# EAGLE schematic EMG_digital_Part (EAGLE 9.3.0)
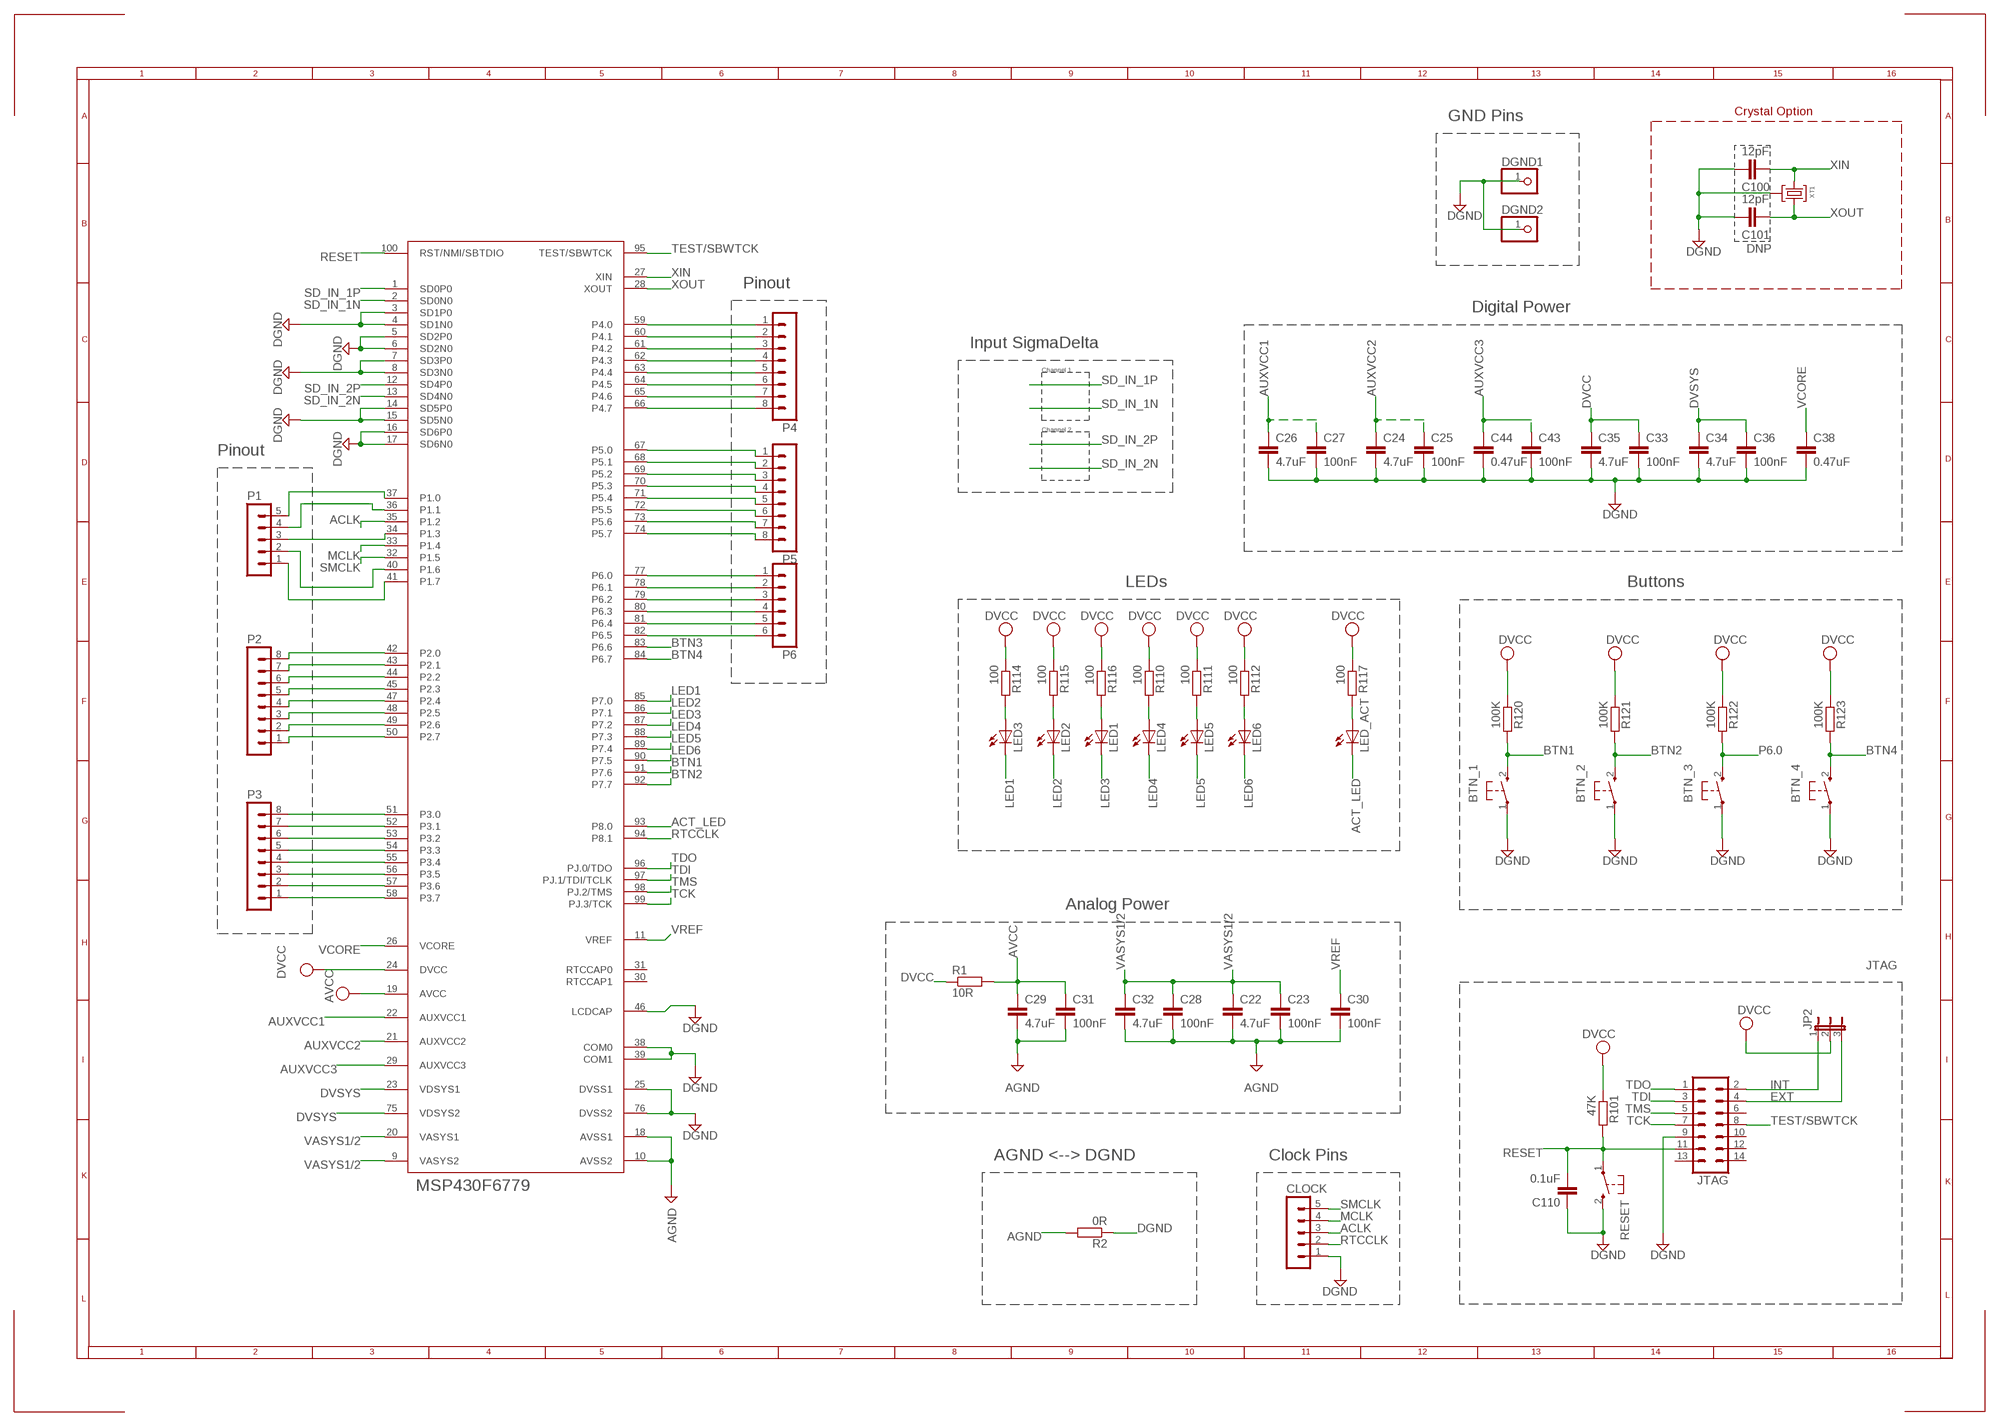
[diagram p0: schematic, sheet 1]

## Parts
BTN_1  PB  [PBTH]
BTN_2  PB  [PBTH]
BTN_3  PB  [PBTH]
BTN_4  PB  [PBTH]
C22  4.7uF  C-EUC0805  [C0805]
C23  100nF  C-EUC0805  [C0805]
C24  4.7uF  C-EUC0805  [C0805]
C25  100nF  C-EUC0805  [C0805]
C26  4.7uF  C-EUC0805  [C0805]
C27  100nF  C-EUC0805  [C0805]
C28  100nF  C-EUC0805  [C0805]
C29  4.7uF  C-EUC0805  [C0805]
C30  100nF  C-EUC0805  [C0805]
C31  100nF  C-EUC0805  [C0805]
C32  4.7uF  C-EUC0805  [C0805]
C33  100nF  C-EUC0805  [C0805]
C34  4.7uF  C-EUC0805  [C0805]
C35  4.7uF  C-EUC0805  [C0805]
C36  100nF  C-EUC0805  [C0805]
C38  0.47uF  C-EUC0805  [C0805]
C43  100nF  C-EUC0805  [C0805]
C44  0.47uF  C-EUC0805  [C0805]
C100  12pF  C-EUC0805  [C0805]
C101  12pF  C-EUC0805  [C0805]
C110  0.1uF  C-EUC0805  [C0805]
CLOCK  MA05-1  [MA05-1]
DGND1  PINHD-1X1  [1X01]
DGND2  PINHD-1X1  [1X01]
JP2  JP2E  [JP2]
JTAG  ML14  [ML14]
LED1  LED3MM  [LED3MM]
LED2  LED3MM  [LED3MM]
LED3  LED3MM  [LED3MM]
LED4  LED3MM  [LED3MM]
LED5  LED3MM  [LED3MM]
LED6  LED3MM  [LED3MM]
LED_ACT  LED3MM  [LED3MM]
P1  MA05-1  [MA05-1]
P2  MA08-1  [MA08-1]
P3  MA08-1  [MA08-1]
P4  MA08-1  [MA08-1]
P5  MA08-1  [MA08-1]
P6  MA06-1  [MA06-1]
R1  10R  R-EU_R0805  [R0805]
R2  0R  R-EU_R0805  [R0805]
R101  47K  R-EU_R0805  [R0805]
R110  100  R-EU_R0805  [R0805]
R111  100  R-EU_R0805  [R0805]
R112  100  R-EU_R0805  [R0805]
R114  100  R-EU_R0805  [R0805]
R115  100  R-EU_R0805  [R0805]
R116  100  R-EU_R0805  [R0805]
R117  100  R-EU_R0805  [R0805]
R120  100K  R-EU_R0805  [R0805]
R121  100K  R-EU_R0805  [R0805]
R122  100K  R-EU_R0805  [R0805]
R123  100K  R-EU_R0805  [R0805]
RESET  RESET  PB  [PBTH]
U$1  MSP430F6779PZ  [S-PQFP-G100(PZ)]
XT1  CM200T  [CM200T]

## Nets
ACLK: CLOCK.3 U$1.35(P1.2)
ACT_LED: LED_ACT.K(C) U$1.93(P8.0)
AGND: C22.2 C23.2 C28.2 C29.2 C30.2 C31.2 C32.2 R2.2 U$1.10(AVSS2) U$1.18(AVSS1)
AUXVCC1: C26.1 C27.1 U$1.22(AUXVCC1)
AUXVCC2: C24.1 C25.1 U$1.21(AUXVCC2)
AUXVCC3: C43.1 C44.1 U$1.29(AUXVCC3)
AVCC: C29.1 C31.1 R1.2 U$1.19(AVCC)
BTN1: BTN_1.2(S) R120.2 U$1.91(P7.6)
BTN2: BTN_2.2(S) R121.2 U$1.92(P7.7)
BTN3: U$1.83(P6.6)
BTN4: BTN_4.2(S) R123.2 U$1.84(P6.7)
DGND: BTN_1.1(P) BTN_2.1(P) BTN_3.1(P) BTN_4.1(P) C24.2 C25.2 C26.2 C27.2 C33.2 C34.2 C35.2 C36.2 C38.2 C43.2 C44.2 C100.2 C101.2 C110.1 CLOCK.1 DGND1.1 DGND2.1 JTAG.9 R2.1 RESET.2(S) U$1.3(SD1P0) U$1.4(SD1N0) U$1.5(SD2P0) U$1.6(SD2N0) U$1.7(SD3P0) U$1.8(SD3N0) U$1.14(SD5P0) U$1.15(SD5N0) U$1.16(SD6P0) U$1.17(SD6N0) U$1.25(DVSS1) U$1.38(COM0) U$1.39(COM1) U$1.46(LCDCAP) U$1.76(DVSS2) XT1.P3
DVCC: C33.1 C35.1 JP2.2 R1.1 R101.1 R110.1 R111.1 R112.1 R114.1 R115.1 R116.1 R117.1 R120.1 R121.1 R122.1 R123.1 U$1.24(DVCC)
DVSYS: C34.1 C36.1 U$1.23(VDSYS1) U$1.75(VDSYS2)
EXT: JP2.3 JTAG.4
INT: JP2.1 JTAG.2
LED1: LED3.K(C) U$1.85(P7.0)
LED2: LED2.K(C) U$1.86(P7.1)
LED3: LED1.K(C) U$1.87(P7.2)
LED4: LED4.K(C) U$1.88(P7.3)
LED5: LED5.K(C) U$1.89(P7.4)
LED6: LED6.K(C) U$1.90(P7.5)
MCLK: CLOCK.4 U$1.33(P1.4)
N$2: LED2.A R115.2
N$3: P5.1 U$1.67(P5.0)
N$4: LED3.A R114.2
N$5: P6.2 U$1.78(P6.1)
N$12: P1.1 U$1.41(P1.7)
N$13: P1.2 U$1.40(P1.6)
N$14: P1.3 U$1.34(P1.3)
N$15: P1.4 U$1.36(P1.1)
N$16: P1.5 U$1.37(P1.0)
N$17: P5.2 U$1.68(P5.1)
N$18: P5.3 U$1.69(P5.2)
N$19: P5.4 U$1.70(P5.3)
N$20: P2.8 U$1.42(P2.0)
N$21: LED4.A R110.2
N$22: P2.7 U$1.43(P2.1)
N$23: P2.6 U$1.44(P2.2)
N$24: P2.5 U$1.45(P2.3)
N$25: P2.4 U$1.47(P2.4)
N$26: P2.3 U$1.48(P2.5)
N$27: LED5.A R111.2
N$28: P2.2 U$1.49(P2.6)
N$29: P2.1 U$1.50(P2.7)
N$30: LED1.A R116.2
N$31: P3.8 U$1.51(P3.0)
N$32: P3.7 U$1.52(P3.1)
N$33: P3.6 U$1.53(P3.2)
N$34: P3.5 U$1.54(P3.3)
N$35: P3.4 U$1.55(P3.4)
N$36: LED6.A R112.2
N$37: P3.3 U$1.56(P3.5)
N$38: P3.2 U$1.57(P3.6)
N$39: P3.1 U$1.58(P3.7)
N$40: P5.5 U$1.71(P5.4)
N$41: P5.6 U$1.72(P5.5)
N$42: P5.7 U$1.73(P5.6)
N$43: P5.8 U$1.74(P5.7)
N$44: P4.5 U$1.63(P4.4)
N$46: LED_ACT.A R117.2
P4.0: P4.1 U$1.59(P4.0)
P4.1: P4.2 U$1.60(P4.1)
P4.2: P4.3 U$1.61(P4.2)
P4.3: P4.4 U$1.62(P4.3)
P4.5: P4.6 U$1.64(P4.5)
P4.6: P4.7 U$1.65(P4.6)
P4.7: P4.8 U$1.66(P4.7)
P6.0: BTN_3.2(S) P6.1 R122.2 U$1.77(P6.0)
P6.2: P6.3 U$1.79(P6.2)
P6.3: P6.4 U$1.80(P6.3)
P6.4: P6.5 U$1.81(P6.4)
P6.5: P6.6 U$1.82(P6.5)
RESET: C110.2 JTAG.11 R101.2 RESET.1(P) U$1.100(RST/NMI/SBTDIO)
RTCCLK: CLOCK.2 U$1.94(P8.1)
SD_IN_1N: U$1.2(SD0N0)
SD_IN_1P: U$1.1(SD0P0)
SD_IN_2N: U$1.13(SD4N0)
SD_IN_2P: U$1.12(SD4P0)
SMCLK: CLOCK.5 U$1.32(P1.5)
TCK: JTAG.7 U$1.99(PJ.3/TCK)
TDI: JTAG.3 U$1.97(PJ.1/TDI/TCLK)
TDO: JTAG.1 U$1.96(PJ.0/TDO)
TEST/SBWTCK: JTAG.8 U$1.95(TEST/SBWTCK)
TMS: JTAG.5 U$1.98(PJ.2/TMS)
VASYS1/2: C22.1 C23.1 C28.1 C32.1 U$1.9(VASYS2) U$1.20(VASYS1)
VCORE: C38.1 U$1.26(VCORE)
VREF: C30.1 U$1.11(VREF)
XIN: C100.1 U$1.27(XIN) XT1.P2
XOUT: C101.1 U$1.28(XOUT) XT1.P1
Unconnected: JTAG.6 JTAG.10 JTAG.12 JTAG.13 JTAG.14 U$1.30(RTCCAP1) U$1.31(RTCCAP0)

## Notes on the sheet
- Crystal Option
- GND Pins
- DNP
- Pinout
- Digital Power
- Input SigmaDelta
- Channel 1
- Channel 2
- Pinout
- LEDs | Buttons
- Analog Power
- JTAG
- AGND <--> DGND | Clock Pins

## Library data of the parts
BTN_1-BTN_4 RESET = electricalmeter:PB: OMRON SWITCH
C22-C36 C38 C43 C44 C100 C101 C110 = resistor:C-EU: CAPACITOR, European symbol
CLOCK P1 = con-lstb:MA05-1: PIN HEADER; OC_FARNELL: unknown; OC_NEWARK: unknown
DGND1 DGND2 = pinhead:PINHD-1X1: PIN HEADER
JP2 = custom_jumper:JP2E: JUMPER
JTAG = con-ml:ML14: HARTING; OC_FARNELL: unknown; OC_NEWARK: unknown
LED1-LED6 LED_ACT = led:LED: LED OSRAM: - CHIPLED LG R971, LG N971, LY N971, LG Q971, LY Q971, LO R971, LY R971 LH N974, LH R974 LS Q976, LO Q976, LY Q976 LO Q996 - Hyper CHIPLED LW Q18S LB Q993, LB Q99A, LB R99A - SideLED LS A670, LO A670, LY A670, LG A670, LP A670 LB A673, LV A673, LT A673, LW A673 LH A674 LY A675 LS A676, LA A676, LO A676, LY A676, LW A676 LS A679, LY A679, LG A679 - Hyper Micro SIDELED® LS Y876, LA Y876, LO Y876, LY Y876 LT Y87S - SmartLED LW L88C, LW L88S LB L89C, LB L89S, LG L890 LS L89K, LO L89K, LY L89K LS L896, LA L896, LO L896, LY L896 - TOPLED LS T670, LO T670, LY T670, LG T670, LP T670 LSG T670, LSP T670, LSY T670, LOP T670, LYG T670 LG T671, LOG T671, LSG T671 LB T673, LV T673, LT T673, LW T673 LH T674 LS T676, LA T676, LO T676, LY T676, LB T676, LH T676, LSB T676, LW T676 LB T67C, LV T67C, LT T67C, LS T67K, LO T67K, LY T67K, LW E67C LS E67B, LA E67B, LO E67B, LY E67B, LB E67C, LV E67C, LT E67C LW T67C LS T679, LY T679, LG T679 LS T770, LO T770, LY T770, LG T770, LP T770 LB T773, LV T773, LT T773, LW T773 LH T774 LS E675, LA E675, LY E675, LS T675 LS T776, LA T776, LO T776, LY T776, LB T776 LHGB T686 LT T68C, LB T68C - Hyper Mini TOPLED® LB M676 - Mini TOPLED Santana® LG M470 LS M47K, LO M47K, LY M47K Source: http://www.osram.convergy.de LUXEON: - LUMILED® LXK2-PW12-R00, LXK2-PW12-S00, LXK2-PW14-U00, LXK2-PW14-V00 LXK2-PM12-R00, LXK2-PM12-S00, LXK2-PM14-U00 LXK2-PE12-Q00, LXK2-PE12-R00, LXK2-PE12-S00, LXK2-PE14-T00, LXK2-PE14-U00 LXK2-PB12-K00, LXK2-PB12-L00, LXK2-PB12-M00, LXK2-PB14-N00, LXK2-PB14-P00, LXK2-PB14-Q00 LXK2-PR12-L00, LXK2-PR12-M00, LXK2-PR14-Q00, LXK2-PR14-R00 LXK2-PD12-Q00, LXK2-PD12-R00, LXK2-PD12-S00 LXK2-PH12-R00, LXK2-PH12-S00 LXK2-PL12-P00, LXK2-PL12-Q00, LXK2-PL12-R00 Source: www.luxeon.com KINGBRIGHT: KA-3528ASYC Source: www.kingbright.com
P2-P5 = con-lstb:MA08-1: PIN HEADER; OC_FARNELL: unknown; OC_NEWARK: unknown
P6 = con-lstb:MA06-1: PIN HEADER; OC_FARNELL: unknown; OC_NEWARK: unknown
R1 R2 R101 R110-R112 R114-R117 R120-R123 = resistor:R-EU_: RESISTOR, European symbol
U$1 = MSP430F6779:MSP430F6779: MSP430F6779
XT1 = F20xx PIR Demo & Eval:CM200T